# EasyEDA schematic Arduino_Pro_Micro_Stepper_Shield.json
TITLE: Sheet_1; REV: 1.0; Date: 2023-10-19; Sheet: 1/1; Drawn By: AmirB; Company: Your Company
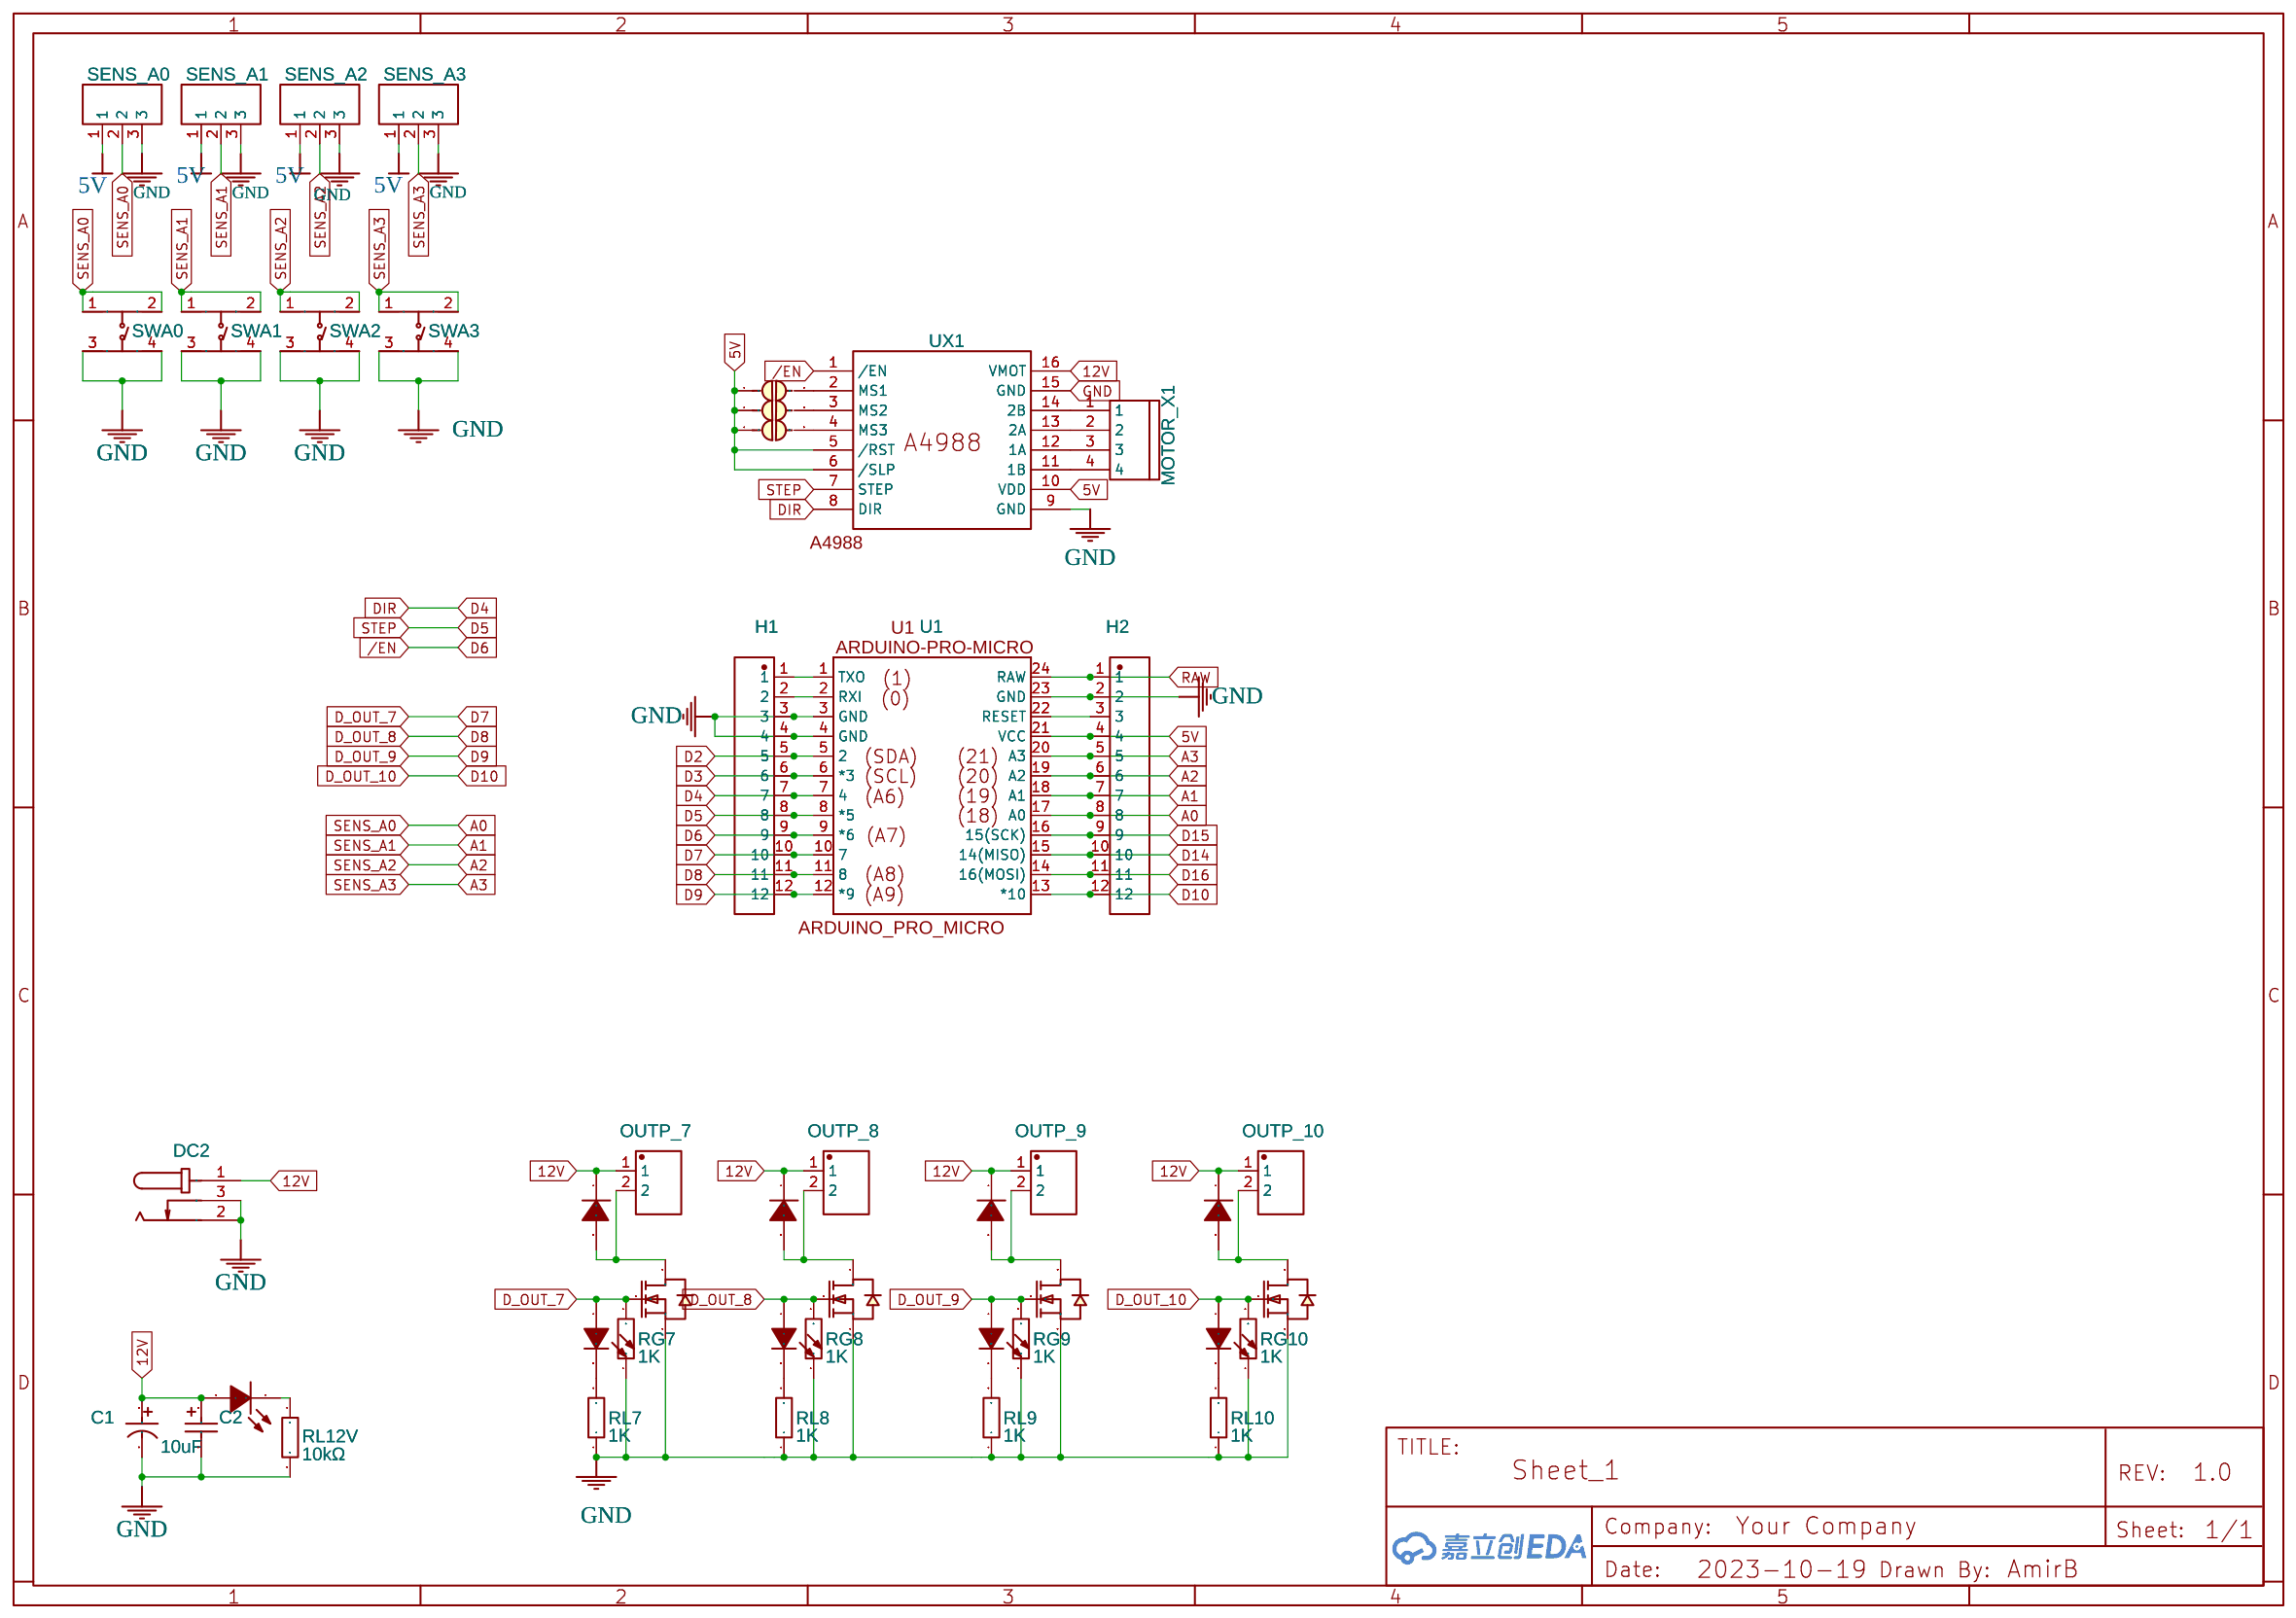
[diagram p0: schematic sheet]

## Parts
C1  470uF  [CAP-TH_BD8.0-P3.50-D0.6-FD]
C2  10uF  [CAP-SMD_L3.2-W1.6-RD-C7171]
DC2  DC  [DC-IN-TH_DC005]
DOUT7  1N4007  [SMAF_L3.5-W2.6-LS4.7-RD]
DOUT8  1N4007  [SMAF_L3.5-W2.6-LS4.7-RD]
DOUT9  1N4007  [SMAF_L3.5-W2.6-LS4.7-RD]
DOUT10  1N4007  [SMAF_L3.5-W2.6-LS4.7-RD]
DQ7  Q  [SOT-23-3_L2.9-W1.3-P0.95-LS2.4-BR]
DQ8  Q  [SOT-23-3_L2.9-W1.3-P0.95-LS2.4-BR]
DQ9  Q  [SOT-23-3_L2.9-W1.3-P0.95-LS2.4-BR]
DQ10  Q  [SOT-23-3_L2.9-W1.3-P0.95-LS2.4-BR]
H1  KH-2.54PH180-1X12P-L11.5  [HDR-TH_12P-P2.54-V-M]
H2  KH-2.54PH180-1X12P-L11.5  [HDR-TH_12P-P2.54-V-M]
JX1  JUMPER-SMT_2  [JUMPERS_SMT-JUMPER_2_NC_PASTE_NO-SILK]
JX2  JUMPER-SMT_2  [JUMPERS_SMT-JUMPER_2_NC_PASTE_NO-SILK]
JX3  JUMPER-SMT_2  [JUMPERS_SMT-JUMPER_2_NC_PASTE_NO-SILK]
LD7  LED  [LED0603-R-RD_BLUE]
LD8  LED  [LED0603-R-RD_BLUE]
LD9  LED  [LED0603-R-RD_BLUE]
LD10  LED  [LED0603-R-RD_BLUE]
LED1  KT-0603R  [LED0603-RD]
MOTOR_X1  XH2.54-4AW  [CONN-TH_XH2.54-4AW]
OUTP_7  KF2510-2A  [CONN-TH_KF2510-2A]
OUTP_8  KF2510-2A  [CONN-TH_KF2510-2A]
OUTP_9  KF2510-2A  [CONN-TH_KF2510-2A]
OUTP_10  KF2510-2A  [CONN-TH_KF2510-2A]
RG7  1K  [R0603]
RG8  1K  [R0603]
RG9  1K  [R0603]
RG10  1K  [R0603]
RL7  1K  [R0603]
RL8  1K  [R0603]
RL9  1K  [R0603]
RL10  1K  [R0603]
RL12V  10kΩ  [R0603]
SENS_A0  FK2510  [CONN-TH_3P-P2.00_KF2510_3A]
SENS_A1  FK2510  [CONN-TH_3P-P2.00_KF2510_3A]
SENS_A2  FK2510  [CONN-TH_3P-P2.00_KF2510_3A]
SENS_A3  FK2510  [CONN-TH_3P-P2.00_KF2510_3A]
SWA0  TC-6610-7-160G  [SW-TH_4P-L5.0-W5.0-P4.50-LS6.5]
SWA1  TC-6610-7-160G  [SW-TH_4P-L5.0-W5.0-P4.50-LS6.5]
SWA2  TC-6610-7-160G  [SW-TH_4P-L5.0-W5.0-P4.50-LS6.5]
SWA3  TC-6610-7-160G  [SW-TH_4P-L5.0-W5.0-P4.50-LS6.5]
U1  ARDUINO-PRO-MICRO  [ARDUINO_PRO_MICRO]
UX1  A4988  [A4988]

## Library data of the parts
C1 = 470uF 25V 8*12Black high frequency: Supplier: LCSC; Manufacturer: CX(承兴); Supplier Part: C44602; JLCPCB Part Class: Extended Part; Package Display: No
C2 = TAJA106K016RNJ: Supplier: LCSC; Manufacturer: Kyocera AVX; Supplier Part: C7171; JLCPCB Part Class: Basic Part; Package Display: No
DC2 = DC005-2.0MM: Supplier: LCSC; Manufacturer: SOFNG; Supplier Part: C111567; Package Display: No
DOUT7-DOUT10 = 1N4007F: Supplier: LCSC; Manufacturer: SK; Supplier Part: C110856; JLCPCB Part Class: Extended Part; Package Display: No
DQ7-DQ10 = JSM2302: Supplier: LCSC; Supplier Part: C5224189; Manufacturer: ElecSuper(静芯微）; Manufacturer Part: AO3400; Contributor: LCSC; JLCPCB Part Class: Extended Part; Package Display: No
H1 H2 = KH-2.54PH180-1X12P-L11.5: Contributor: LCSC; Supplier: LCSC; Supplier Part: C2905489; Manufacturer: kinghelm(金航标); JLCPCB Part Class: Extended Part; Package Display: No
JX1-JX3 = JUMPER-SMT_2: Contributor: P-Thomsen; Package Display: No
LD7-LD10 = 19-217/BHC-ZL1M2RY/3T: Supplier: LCSC; Manufacturer: EVERLIGHT; Supplier Part: C72041; JLCPCB Part Class: Basic Part; Package Display: No
LED1 = KT-0603R: Supplier: LCSC; Manufacturer: KENTO; Supplier Part: C2286; JLCPCB Part Class: Basic Part; Package Display: No
MOTOR_X1 = XH2.54-4AW: JLCPCB Part Class: Extended Part; Package Display: No
OUTP_7-OUTP_10 = KF2510-2A: Supplier: LCSC; Manufacturer: BOOMELE; Supplier Part: C27543; JLCPCB Part Class: Extended Part; Package Display: No
RG7-RG10 RL7-RL10 = 0603WAF1001T5E: Supplier: LCSC; Manufacturer: UniOhm; Supplier Part: C21190; JLCPCB Part Class: Basic Part; Package Display: No
RL12V = 0603WAF1002T5E: Supplier: LCSC; Manufacturer: UNI-ROYAL(厚声); Supplier Part: C25804; Resistance (Ohms): 10K; JLCPCB Part Class: Basic Part; Package Display: No
SENS_A0-SENS_A3 = kf2510_3A: JLCPCB Part Class: Extended Part; Package Display: No
SWA0-SWA3 = TC-6610-7-160G: Contributor: LCSC; Supplier: LCSC; Supplier Part: C2845252; Manufacturer: HCTL(华灿天禄); JLCPCB Part Class: Extended Part; Package Display: No
U1 = ARDUINO-PRO-MICRO: Contributor: ah19; Package Display: Yes
UX1 = A4988: Contributor: unaja_closp; Package Display: Yes

## Nets
5V: H2.4 JX1.1 JX2.1 JX3.1 SENS_A0.1 SENS_A1.1 SENS_A2.1 SENS_A3.1 U1.21(VCC) UX1.5(/RST) UX1.6(/SLP) UX1.10(VDD)
12V: C1.1 C2.1 DC2.1 DOUT7.1(C) DOUT8.1(C) DOUT9.1(C) DOUT10.1(C) LED1.2(A) OUTP_7.1 OUTP_8.1 OUTP_9.1 OUTP_10.1 UX1.16(VMOT)
GND: C1.2 C2.2 DC2.2 DC2.3 DQ7.2(S) DQ8.2(S) DQ9.2(S) DQ10.2(S) H1.3 H1.4 H2.2 RG7.1 RG8.1 RG9.1 RG10.1 RL7.1 RL8.1 RL9.1 RL10.1 RL12V.2 SENS_A0.3 SENS_A1.3 SENS_A2.3 SENS_A3.3 SWA0.3 SWA0.4 SWA1.3 SWA1.4 SWA2.3 SWA2.4 SWA3.3 SWA3.4 U1.3(GND) U1.4(GND) U1.23(GND) UX1.9(GND) UX1.15(GND)
/EN: H1.9 U1.9(*6) UX1.1(/EN)
A0: H2.8 SENS_A0.2 SWA0.1 SWA0.2 U1.17(A0)
A1: H2.7 SENS_A1.2 SWA1.1 SWA1.2 U1.18(A1)
A2: H2.6 SENS_A2.2 SWA2.1 SWA2.2 U1.19(A2)
A3: H2.5 SENS_A3.2 SWA3.1 SWA3.2 U1.20(A3)
D2: H1.5 U1.5(2)
D3: H1.6 U1.6(*3)
D4: H1.7 U1.7(4) UX1.8(DIR)
D5: H1.8 U1.8(*5) UX1.7(STEP)
D7: DQ7.1(G) H1.10 LD7.1(A) RG7.2 U1.10(7)
D8: DQ8.1(G) H1.11 LD8.1(A) RG8.2 U1.11(8)
D9: DQ9.1(G) H1.12 LD9.1(A) RG9.2 U1.12(*9)
D10: DQ10.1(G) H2.12 LD10.1(A) RG10.2 U1.13(*10)
D14: H2.10 U1.15(14(MISO))
D15: H2.9 U1.16(15(SCK))
D16: H2.11 U1.14(16(MOSI))
RAW: H2.1 U1.24(RAW)
Net-(DOUT7-2): DOUT7.2(A) DQ7.3(D) OUTP_7.2
Net-(DOUT8-2): DOUT8.2(A) DQ8.3(D) OUTP_8.2
Net-(DOUT9-2): DOUT9.2(A) DQ9.3(D) OUTP_9.2
Net-(DOUT10-2): DOUT10.2(A) DQ10.3(D) OUTP_10.2
Net-(H1-1): H1.1 U1.1(TXO)
Net-(H1-2): H1.2 U1.2(RXI)
Net-(H2-3): H2.3 U1.22(RESET)
Net-(JX1-2): JX1.2 UX1.2(MS1)
Net-(JX2-2): JX2.2 UX1.3(MS2)
Net-(JX3-2): JX3.2 UX1.4(MS3)
Net-(LD7-2): LD7.2(C) RL7.2
Net-(LD8-2): LD8.2(C) RL8.2
Net-(LD9-2): LD9.2(C) RL9.2
Net-(LD10-2): LD10.2(C) RL10.2
Net-(LED1-1): LED1.1(K) RL12V.1
Net-(MOTOR_X1-1): MOTOR_X1.1 UX1.14(2B)
Net-(MOTOR_X1-2): MOTOR_X1.2 UX1.13(2A)
Net-(MOTOR_X1-3): MOTOR_X1.3 UX1.12(1A)
Net-(MOTOR_X1-4): MOTOR_X1.4 UX1.11(1B)
